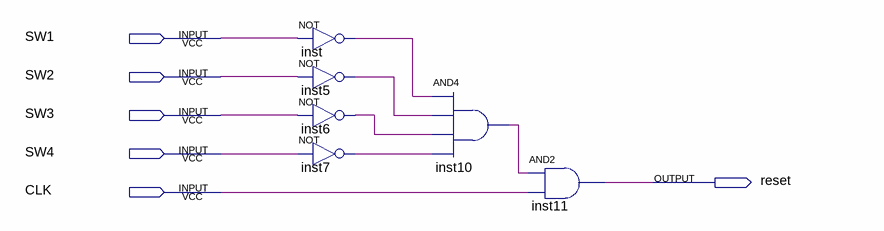
[diagram p0: schematic sheet]
// Quartus schematic offdetector.bdf as structural Verilog: 6 symbols, 6 pins
module offdetector (
  input  SW1,
  input  SW2,
  input  SW3,
  input  SW4,
  input  CLK,
  output reset
);

  wire inst5_out, inst6_out, inst7_out, inst10_out, inst_out;

  not inst (inst_out, SW1);
  not inst5 (inst5_out, SW2);
  not inst6 (inst6_out, SW3);
  not inst7 (inst7_out, SW4);
  and inst10 (inst10_out, inst_out, inst5_out, inst6_out, inst7_out);
  and inst11 (reset, inst10_out, CLK);
endmodule
